# EasyEDA Pro project Control_Logic.eprj

# Schematic Schematic1
Board Name: Board1; Create Date: 2025-08-20; Page Name: P1; Project Name: Control_Logic; Schematic Name: Schematic1; Update Date: 2025-08-26; Company: EasyEDA.com; Page Size: A4; Version: V1.0
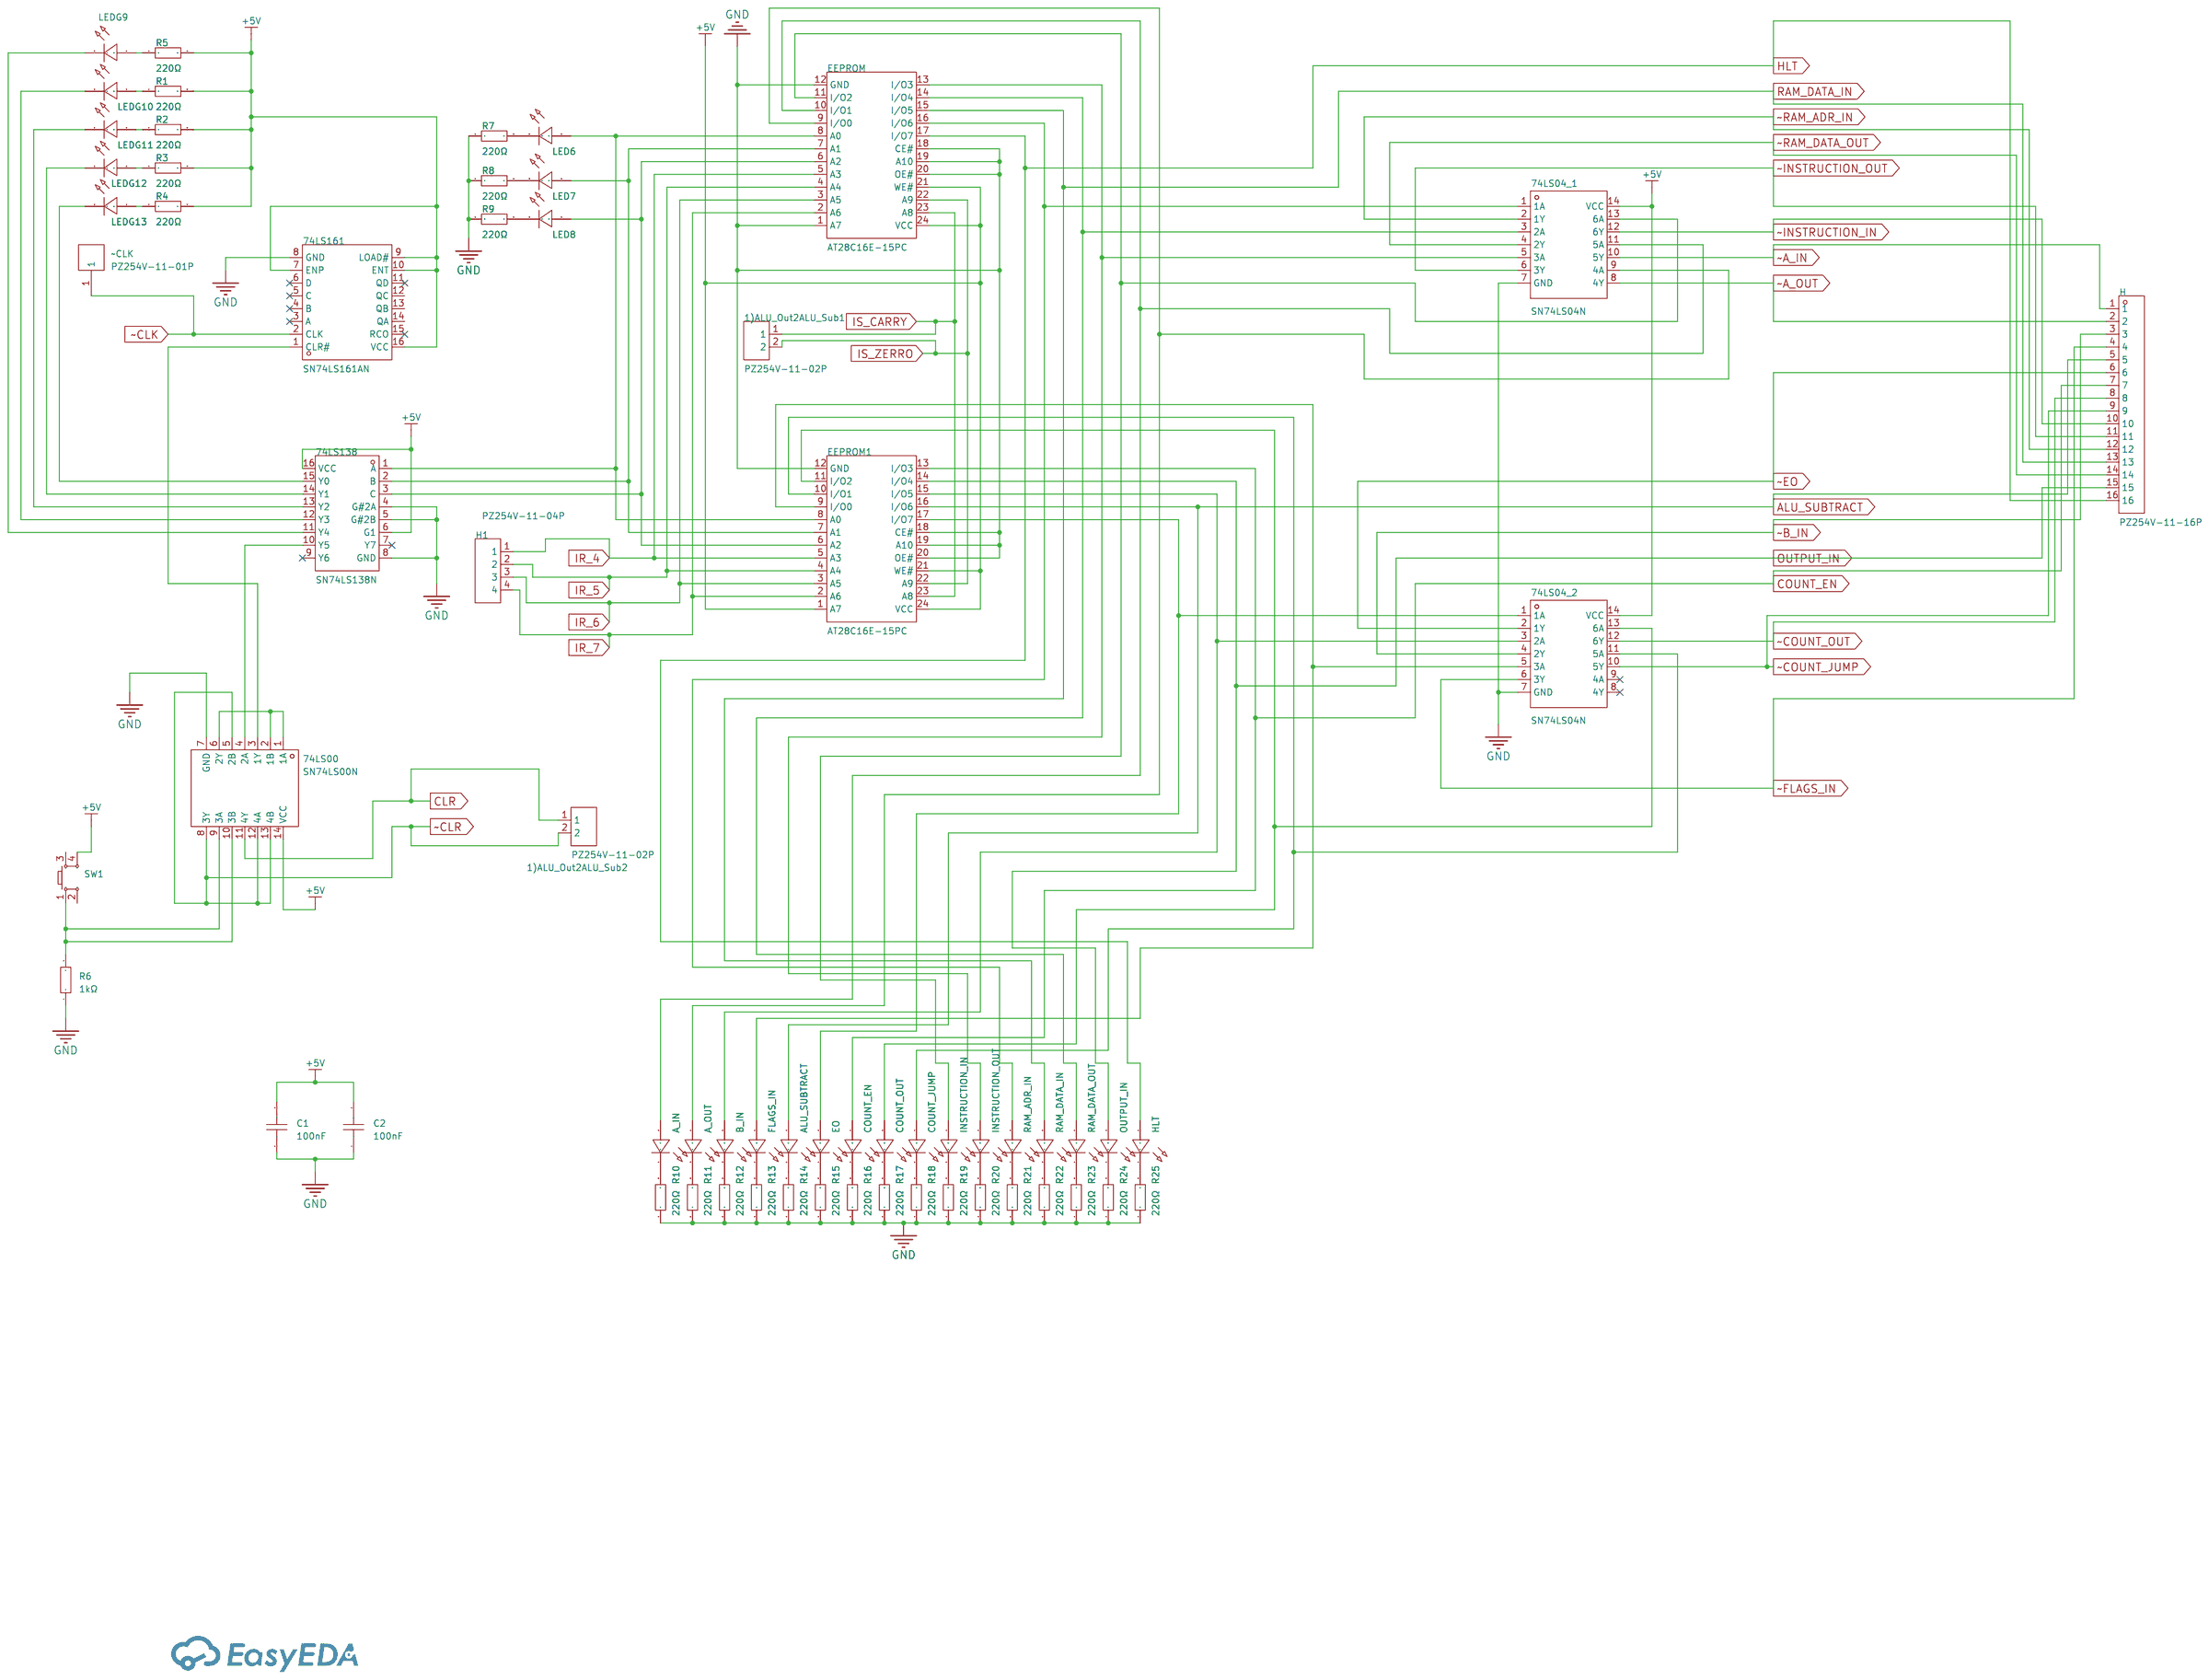
[diagram p0: schematic sheet]

## Parts
1)ALU_Out2ALU_Sub1  PZ254V-11-02P  [HDR-TH_2P-P2.54-V-M]
1)ALU_Out2ALU_Sub2  PZ254V-11-02P  [HDR-TH_2P-P2.54-V-M]
74LS00  SN74LS00N  [PDIP-14_L19.7-W6.6-P2.54-LS8.3-BL]
74LS04_1  SN74LS04N  [PDIP-14_L19.7-W6.6-P2.54-LS8.3-BL]
74LS04_2  SN74LS04N  [PDIP-14_L19.7-W6.6-P2.54-LS8.3-BL]
74LS138  SN74LS138N  [DIP-16_L19.8-W6.5-P2.54-LS7.6-BL]
74LS161  SN74LS161AN  [PDIP-16_L19.3-W6.4-P2.54-LS7.9-BL]
A_IN  -  [LED-TH_BD5.8-P2.54-FD]
A_OUT  -  [LED-TH_BD5.8-P2.54-FD]
ALU_SUBTRACT  -  [LED-TH_BD5.8-P2.54-FD]
B_IN  -  [LED-TH_BD5.8-P2.54-FD]
C1  100nF  [CAP-TH_L8.5-W5.0-P5.00-D1.2]
C2  100nF  [CAP-TH_L8.5-W5.0-P5.00-D1.2]
COUNT_EN  -  [LED-TH_BD5.8-P2.54-FD]
COUNT_JUMP  -  [LED-TH_BD5.8-P2.54-FD]
COUNT_OUT  -  [LED-TH_BD5.8-P2.54-FD]
EEPROM  AT28C16E-15PC  [PDIP-24_L31.0-W13.5-P2.54-LS15.2-BL]
EEPROM1  AT28C16E-15PC  [PDIP-24_L31.0-W13.5-P2.54-LS15.2-BL]
EO  -  [LED-TH_BD5.8-P2.54-FD]
FLAGS_IN  -  [LED-TH_BD5.8-P2.54-FD]
H  PZ254V-11-16P  [HDR-TH_PZ254V-11-16P]
H1  PZ254V-11-04P  [HDR-TH_4P-P2.54-V-M]
HLT  -  [LED-TH_BD5.8-P2.54-FD]
INSTRUCTION_IN  -  [LED-TH_BD5.8-P2.54-FD]
INSTRUCTION_OUT  -  [LED-TH_BD5.8-P2.54-FD]
LED6  -  [LED-TH_BD5.8-P2.54-FD]
LED7  -  [LED-TH_BD5.8-P2.54-FD]
LED8  -  [LED-TH_BD5.8-P2.54-FD]
LEDG9  -  [LED-TH_BD5.8-P2.54-FD]
LEDG10  -  [LED-TH_BD5.8-P2.54-FD]
LEDG11  -  [LED-TH_BD5.8-P2.54-FD]
LEDG12  -  [LED-TH_BD5.8-P2.54-FD]
LEDG13  -  [LED-TH_BD5.8-P2.54-FD]
OUTPUT_IN  -  [LED-TH_BD5.8-P2.54-FD]
R1  220Ω  [R_AXIAL-0.4]
R2  220Ω  [R_AXIAL-0.4]
R3  220Ω  [R_AXIAL-0.4]
R4  220Ω  [R_AXIAL-0.4]
R5  220Ω  [R_AXIAL-0.4]
R6  1kΩ  [R_AXIAL-0.4]
R7  220Ω  [R_AXIAL-0.4]
R8  220Ω  [R_AXIAL-0.4]
R9  220Ω  [R_AXIAL-0.4]
R10  220Ω  [R_AXIAL-0.4]
R11  220Ω  [R_AXIAL-0.4]
R12  220Ω  [R_AXIAL-0.4]
R13  220Ω  [R_AXIAL-0.4]
R14  220Ω  [R_AXIAL-0.4]
R15  220Ω  [R_AXIAL-0.4]
R16  220Ω  [R_AXIAL-0.4]
R17  220Ω  [R_AXIAL-0.4]
R18  220Ω  [R_AXIAL-0.4]
R19  220Ω  [R_AXIAL-0.4]
R20  220Ω  [R_AXIAL-0.4]
R21  220Ω  [R_AXIAL-0.4]
R22  220Ω  [R_AXIAL-0.4]
R23  220Ω  [R_AXIAL-0.4]
R24  220Ω  [R_AXIAL-0.4]
R25  220Ω  [R_AXIAL-0.4]
RAM_ADR_IN  -  [LED-TH_BD5.8-P2.54-FD]
RAM_DATA_IN  -  [LED-TH_BD5.8-P2.54-FD]
RAM_DATA_OUT  -  [LED-TH_BD5.8-P2.54-FD]
SW1  -  [KEY-TH_4P-L6.0-W6.0-P3.90-LS6.5]
~CLK  PZ254V-11-01P  [HDR-TH_1P-P2.54-V-M]

## Library data of the parts
1)ALU_Out2ALU_Sub1 1)ALU_Out2ALU_Sub2 = PZ254V-11-02P: Pin Structure:1x2P Pitch:2.54mm Row Spacing:- Circluar Pins/Square Pins:Policy Mounting Type:Straight Number of Rows:Single Row Number of Pins:2P Current Rating:- Voltage Rating (Max):- Length of Mating Pin:6mm Insulation Height:2.5mm Length of End Connec; LCSC Part Name: 1x2P 间距:2.54mm 方针 直插; Supplier Part: C492401; Manufacturer: XFCN(兴飞); Supplier Footprint: 插件,P=2.54mm; JLCPCB Part Class: Extended Part; Datasheet: https://atta.szlcsc.com/upload/public/pdf/source/20200309/C492401_A812433581A9B211A7FFA413ADDFF0E5.pdf; Supplier: LCSC; Pin Structure: 1x2P; Pitch: 2.54mm; Circluar Pins/Square Pins: Policy; Mounting Type: Straight; Number of Rows: Single Row; Number of Pins: 2P; Length of Mating Pin: 6mm; Insulation Height: 2.5mm; Length of End Connection Pin: 3mm; Contact Material: Brass; Operating Temperature: -40℃~+105℃; Color: Black
74LS00 = SN74LS00N: Logic Type:NAND Gate Number of Channels:4 Voltage - Supply:4.75V~5.25V Voltage - Supply:4.75V~5.25V Current - Output Low(IOL):8mA Current - Output High(IOH):400uA Input Logic Level - High:2V Input Logic Level - High:2V Input Logic Level - Low:800mV Input; Supplier Part: C181629; Manufacturer: TI(德州仪器); Supplier Footprint: PDIP-14; JLCPCB Part Class: Extended Part; Datasheet: https://www.ti.com/cn/lit/gpn/sn74ls00; Supplier: LCSC; Logic Type: NAND Gate; Number of Channels: 4; Voltage - Supply: 4.75V~5.25V; Current - Output Low(IOL): 8mA; Current - Output High(IOH): 400uA; Input Logic Level - High: 2V; Input Logic Level - Low: 800mV; Series: 74LSSeries; Propagation Delay: 15ns@5V,15pF; Operating Temperature: 0℃~+70℃
74LS04_1 74LS04_2 = SN74LS04N: Voltage - Supply:4.75V~5.25V Voltage - Supply:4.75V~5.25V Number of Circuits:6 Number of Inputs:1 Current - Output Low(IOL):8mA Current - Output High(IOH):400uA Input Logic Level - High:2V Input Logic Level - High:2V Input Logic Level -Low:800mV Input Log; Supplier Part: C183657; Manufacturer: TI(德州仪器); Supplier Footprint: PDIP-14; JLCPCB Part Class: Extended Part; Datasheet: https://www.ti.com/cn/lit/gpn/sn74ls04; Supplier: LCSC; Voltage - Supply: 4.75V~5.25V; Number of Circuits: 6; Number of Inputs: 1; Current - Output Low(IOL): 8mA; Current - Output High(IOH): 400uA; Input Logic Level - High: 2V; Input Logic Level -Low: 800mV; Max Propagation Delay: 15ns@5V,15pF; Series: 74LSSeries; Operating Temperature: 0℃~+70℃
74LS138 = SN74LS138N: Type:Decoder/Demultiplexers Voltage Supply Source:Single supply Supply Voltage:4.75V~5.25V Supply Voltage:4.75V~5.25V Sink Current:8mA Source Current:400uA Operating temperature:0℃~+70℃ Operating temperature:0℃~+70℃; Supplier Part: C352964; Manufacturer: TI(德州仪器); Supplier Footprint: DIP-16; JLCPCB Part Class: Extended Part; Datasheet: https://www.ti.com/cn/lit/gpn/sn74ls138; Supplier: LCSC; Type: Decoder/Demultiplexers; Voltage Supply Source: Single supply; Supply Voltage: 4.75V~5.25V; Sink Current: 8mA; Source Current: 400uA; Operating temperature: 0℃~+70℃
74LS161 = SN74LS161AN: Logic Type:Binary Counter Direction:向上计数器 Supply Voltage:4.75V~5.25V Supply Voltage:4.75V~5.25V Number of Elements:1 Number of Bits per Element:4 Trigger Type:Positive Edge Reset Style:异步 Timing mode:Synchronous Count Rate:25MHz Operating Temperature:0℃~+; LCSC Part Name: 25MHz 4位二进制计数器; Supplier Part: C1547960; Manufacturer: TI(德州仪器); Supplier Footprint: PDIP-16; JLCPCB Part Class: Extended Part; Datasheet: https://www.ti.com/cn/lit/gpn/sn74ls161a; Supplier: LCSC; Logic Type: Binary Counter; Direction: 向上计数器; Supply Voltage: 4.75V~5.25V; Number of Elements: 1; Number of Bits per Element: 4; Trigger Type: Positive Edge; Reset Style: 异步; Timing mode: Synchronous; Count Rate: 25MHz; Operating Temperature: 0℃~+70℃
A_IN A_OUT ALU_SUBTRACT B_IN COUNT_EN COUNT_JUMP COUNT_OUT EO FLAGS_IN HLT INSTRUCTION_IN INSTRUCTION_OUT LED6-LED8 LEDG9-LEDG13 OUTPUT_IN RAM_ADR_IN RAM_DATA_IN RAM_DATA_OUT = LED_TH-R_5mm: Supplier Footprint: Through
C1 C2 = CT4-0805B104K500F3: Capacitance:100nF Tolerance:±10% Tolerance:±10% Voltage Rated: Temperature Coefficient:; LCSC Part Name: 100nF ±10% 50V C3型（直脚）; Supplier Part: C84772; Manufacturer: FH(风华); Supplier Footprint: 插件,P=5.08mm; JLCPCB Part Class: Extended Part; Datasheet: https://atta.szlcsc.com/upload/public/pdf/source/20190402/C385200_059806A6312B28FF1421A2413EB641E1.pdf; Supplier: LCSC; Tolerance: ±10%
EEPROM EEPROM1 = AT28C16E-15PC: Supplier Part: C19393057; Manufacturer: MICROCHIP(美国微芯); Supplier Footprint: PDIP-24; JLCPCB Part Class: Extended Part; Datasheet: https://atta.szlcsc.com/upload/public/pdf/source/20231219/98B154FA288F53C07025EE50A49045E4.pdf; Supplier: LCSC
H = PZ254V-11-16P: LCSC Part Name: 排针2.54mm间距 单排 1x16P 直插 方针; Supplier Part: C22465876; Manufacturer: XFCN(兴飞); Supplier Footprint: 插件,P=2.54mm; JLCPCB Part Class: Extended Part; Datasheet: https://atta.szlcsc.com/upload/public/pdf/source/20240617/C325FF89D0FCE13B2A10BE2D3D7E6B84.pdf; Supplier: LCSC
H1 = PZ254V-11-04P_C492403: Pin Structure:1x4P Pitch:2.54mm Row Spacing:- Circluar Pins/Square Pins:Policy Mounting Type:Straight Number of Rows:Single Row Number of Pins:4P Current Rating:- Voltage Rating (Max):- Length of Mating Pin:6mm Insulation Height:2.5mm Length of End Connec; LCSC Part Name: 1x4P 间距:2.54mm 方针 直插; Supplier Part: C492403; Manufacturer: XFCN(兴飞); Supplier Footprint: 插件,P=2.54mm; JLCPCB Part Class: Extended Part; Datasheet: https://atta.szlcsc.com/upload/public/pdf/source/20200309/C492403_F9F19131791D08044AD4F84F8E751A34.pdf; Supplier: LCSC; Pin Structure: 1x4P; Pitch: 2.54mm; Circluar Pins/Square Pins: Policy; Mounting Type: Straight; Number of Rows: Single Row; Number of Pins: 4P; Length of Mating Pin: 6mm; Insulation Height: 2.5mm; Length of End Connection Pin: 3mm; Contact Material: Brass; Operating Temperature: -40℃~+105℃; Color: Black
R1-R25 = Res_AXIAL-1/4W: Supplier Footprint: Through
SW1 = Key_TH_6x6x4.5: Supplier Footprint: Through
~CLK = PZ254V-11-01P: LCSC Part Name: 1x1P 间距:2.54mm 方针 直插; Supplier Part: C492400; Manufacturer: XFCN(兴飞); Supplier Footprint: 插件,P=2.54mm; JLCPCB Part Class: Extended Part; Datasheet: https://atta.szlcsc.com/upload/public/pdf/source/20200309/C492400_46876A5B545F5AE6B8D4A09C46E276E8.pdf; Supplier: LCSC; Pin Structure: 1x1P; Pitch: 2.54mm; Circluar Pins/Square Pins: Policy; Mounting Type: Straight; Number of Rows: Single Row; Number of Pins: 1P; Length of Mating Pin: 6mm; Insulation Height: 2.5mm; Length of End Connection Pin: 3mm; Contact Material: Brass; Operating Temperature: -40℃~+105℃; Color: Black

## Nets
+5V: 74LS00.14(VCC) 74LS04_1.14(VCC) 74LS04_2.14(VCC) 74LS138.6(G1) 74LS138.16(VCC) 74LS161.7(ENP) 74LS161.9(LOAD#) 74LS161.10(ENT) 74LS161.16(VCC) C1.2 C2.2 EEPROM.21(WE#) EEPROM.24(VCC) EEPROM1.1(A7) EEPROM1.21(WE#) EEPROM1.24(VCC) R1.2 R2.2 R3.2 R4.2 R5.2 SW1.4
GND: 74LS00.7(GND) 74LS04_1.7(GND) 74LS04_2.7(GND) 74LS138.4(G#2A) 74LS138.5(G#2B) 74LS138.8(GND) 74LS161.8(GND) C1.1 C2.1 EEPROM.1(A7) EEPROM.12(GND) EEPROM.18(CE#) EEPROM.19(A10) EEPROM.20(OE#) EEPROM1.12(GND) EEPROM1.18(CE#) EEPROM1.19(A10) EEPROM1.20(OE#) R6.1 R7.1 R8.1 R9.1 R10.1 R11.1 R12.1 R13.1 R14.1 R15.1 R16.1 R17.1 R18.1 R19.1 R20.1 R21.1 R22.1 R23.1 R24.1 R25.1
ALU_SUBTRACT: ALU_SUBTRACT.1(C) EEPROM1.16(I/O6) H.5
CLR: 1)ALU_Out2ALU_Sub2.1 74LS00.11(4Y)
COUNT_EN: COUNT_EN.1(C) EEPROM1.13(I/O3) H.7
HLT: EEPROM.17(I/O7) H.16 HLT.1(C)
IR_4: EEPROM.5(A3) EEPROM1.5(A3) H1.1
IR_5: EEPROM.4(A4) EEPROM1.4(A4) H1.2
IR_6: EEPROM.3(A5) EEPROM1.3(A5) H1.3
IR_7: EEPROM.2(A6) EEPROM1.2(A6) H1.4
IS_CARRY: 1)ALU_Out2ALU_Sub1.1 EEPROM.23(A8) EEPROM1.23(A8)
IS_ZERRO: 1)ALU_Out2ALU_Sub1.2 EEPROM.22(A9) EEPROM1.22(A9)
OUTPUT_IN: EEPROM1.14(I/O4) H.15 OUTPUT_IN.1(C)
RAM_DATA_IN: EEPROM.15(I/O5) H.13 RAM_DATA_IN.1(C)
~A_IN: 74LS04_1.10(5Y) H.1
~A_OUT: 74LS04_1.8(4Y) H.2
~B_IN: 74LS04_2.4(2Y) H.3
~CLK: 74LS161.2(CLK) ~CLK.1
~CLR: 1)ALU_Out2ALU_Sub2.2 74LS00.5(2B) 74LS00.8(3Y) 74LS00.12(4A) 74LS00.13(4B)
~COUNT_JUMP: 74LS04_2.10(5Y) H.9
~COUNT_OUT: 74LS04_2.12(6Y) H.8
~EO: 74LS04_2.2(1Y) H.6
~FLAGS_IN: 74LS04_2.6(3Y) H.4
~INSTRUCTION_IN: 74LS04_1.12(6Y) H.10
~INSTRUCTION_OUT: 74LS04_1.6(3Y) H.11
~RAM_ADR_IN: 74LS04_1.2(1Y) H.12
~RAM_DATA_OUT: 74LS04_1.4(2Y) H.14
$1N2639: LEDG9.1(C) R5.1
$1N2640: LEDG10.1(C) R1.1
$1N2641: LEDG11.1(C) R2.1
$1N2642: LEDG12.1(C) R3.1
$1N2643: LEDG13.1(C) R4.1
$1N2644: 74LS138.15(Y0) LEDG13.2(A)
$1N2645: 74LS138.11(Y4) LEDG9.2(A)
$1N2646: 74LS138.14(Y1) LEDG12.2(A)
$1N2647: 74LS138.13(Y2) LEDG11.2(A)
$1N2648: 74LS138.12(Y3) LEDG10.2(A)
$1N2653: 74LS00.9(3A) 74LS00.10(3B) R6.2 SW1.1
$1N2655: 74LS00.4(2A) 74LS138.10(Y5)
$1N2658: 74LS00.1(1A) 74LS00.2(1B) 74LS00.6(2Y)
$1N2659: 74LS00.3(1Y) 74LS161.1(CLR#)
$1N2661: 74LS138.1(A) EEPROM.8(A0) EEPROM1.8(A0) LED6.1(C)
$1N2662: 74LS138.2(B) EEPROM.7(A1) EEPROM1.7(A1) LED7.1(C)
$1N2666: LED6.2(A) R7.2
$1N2667: LED7.2(A) R8.2
$1N2668: LED8.2(A) R9.2
$1N2703: 74LS138.3(C) EEPROM.6(A2) EEPROM1.6(A2) LED8.1(C)
$1N12063: 74LS04_1.3(2A) EEPROM.14(I/O4) RAM_DATA_OUT.1(C)
$1N12068: 74LS04_2.11(5A) COUNT_JUMP.1(C) EEPROM1.10(I/O1)
$1N12073: 74LS04_2.13(6A) COUNT_OUT.1(C) EEPROM1.11(I/O2)
$1N12083: 74LS04_2.1(1A) EEPROM1.17(I/O7) EO.1(C)
$1N12093: 74LS04_2.5(3A) EEPROM1.9(I/O0) FLAGS_IN.1(C)
$1N12098: 74LS04_2.3(2A) B_IN.1(C) EEPROM1.15(I/O5)
$1N12103: 74LS04_1.9(4A) A_OUT.1(C) EEPROM.9(I/O0)
$1N12108: 74LS04_1.11(5A) A_IN.1(C) EEPROM.10(I/O1)
$1N12115: 74LS04_1.13(6A) EEPROM.11(I/O2) INSTRUCTION_IN.1(C)
$1N12122: 74LS04_1.5(3A) EEPROM.13(I/O3) INSTRUCTION_OUT.1(C)
$1N12129: 74LS04_1.1(1A) EEPROM.16(I/O6) RAM_ADR_IN.1(C)
$1N12393: A_IN.2(A) R10.2
$1N12395: A_OUT.2(A) R11.2
$1N12397: B_IN.2(A) R12.2
$1N12399: FLAGS_IN.2(A) R13.2
$1N12401: ALU_SUBTRACT.2(A) R14.2
$1N12403: EO.2(A) R15.2
$1N12405: COUNT_EN.2(A) R16.2
$1N12407: COUNT_OUT.2(A) R17.2
$1N12409: COUNT_JUMP.2(A) R18.2
$1N12411: INSTRUCTION_IN.2(A) R19.2
$1N12413: INSTRUCTION_OUT.2(A) R20.2
$1N12415: R21.2 RAM_ADR_IN.2(A)
$1N12417: R22.2 RAM_DATA_IN.2(A)
$1N12419: R23.2 RAM_DATA_OUT.2(A)
$1N12421: OUTPUT_IN.2(A) R24.2
$1N12423: HLT.2(A) R25.2

Not connected (* = marked no-connect by the designer): 74LS04_2 8(4Y)* 9(4A)*; 74LS138 7(Y7)* 9(Y6)*; 74LS161 3(A)* 4(B)* 5(C)* 6(D)* 11(QD)* 12(QC) 13(QB) 14(QA) 15(RCO)*; SW1 2 3

# Board PCB1
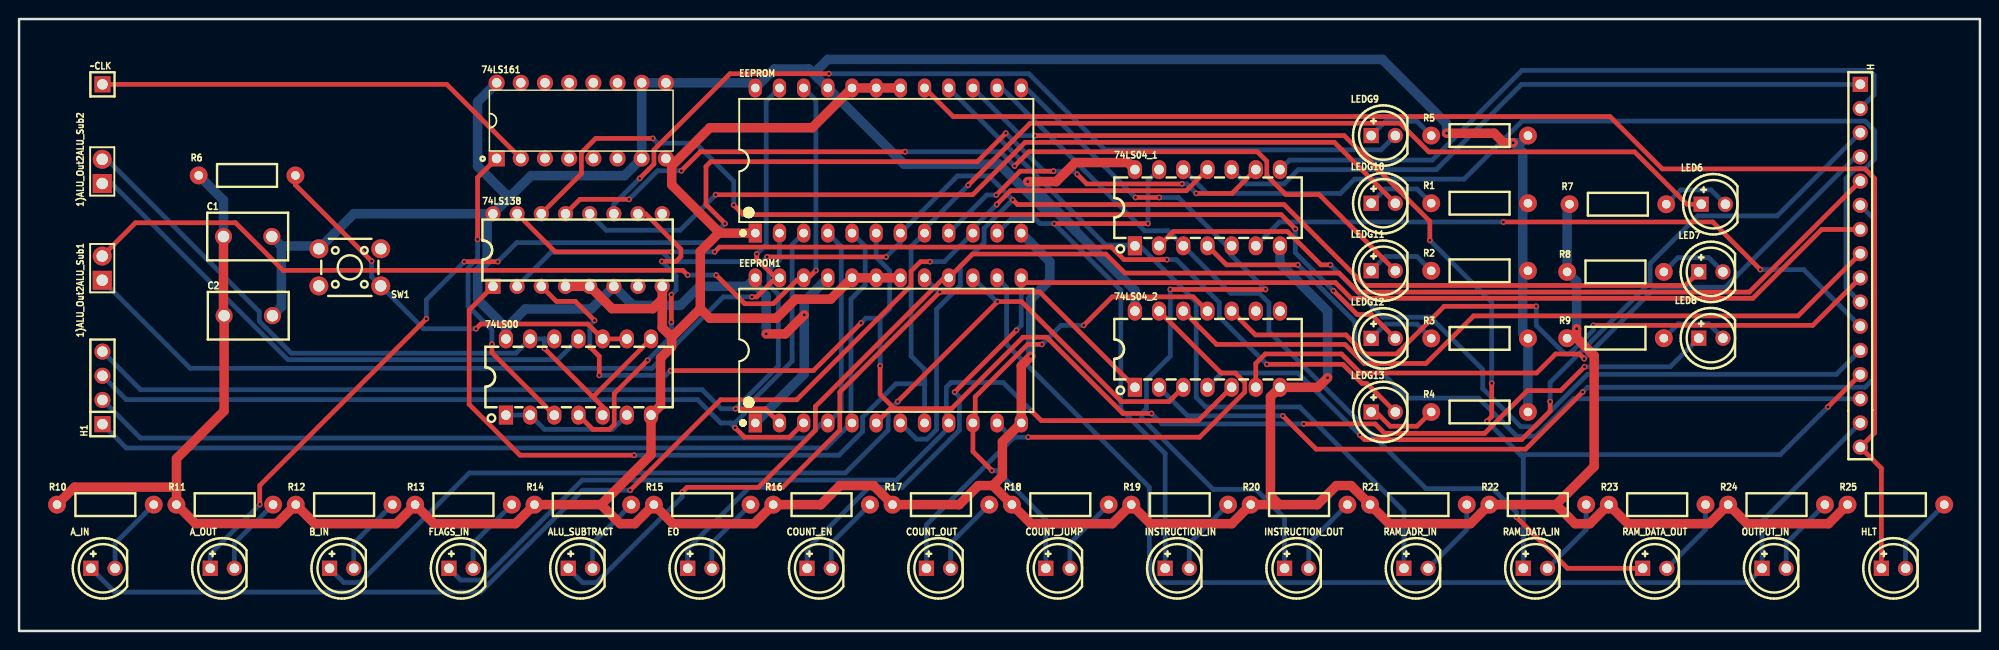
[diagram p1: board, top side]
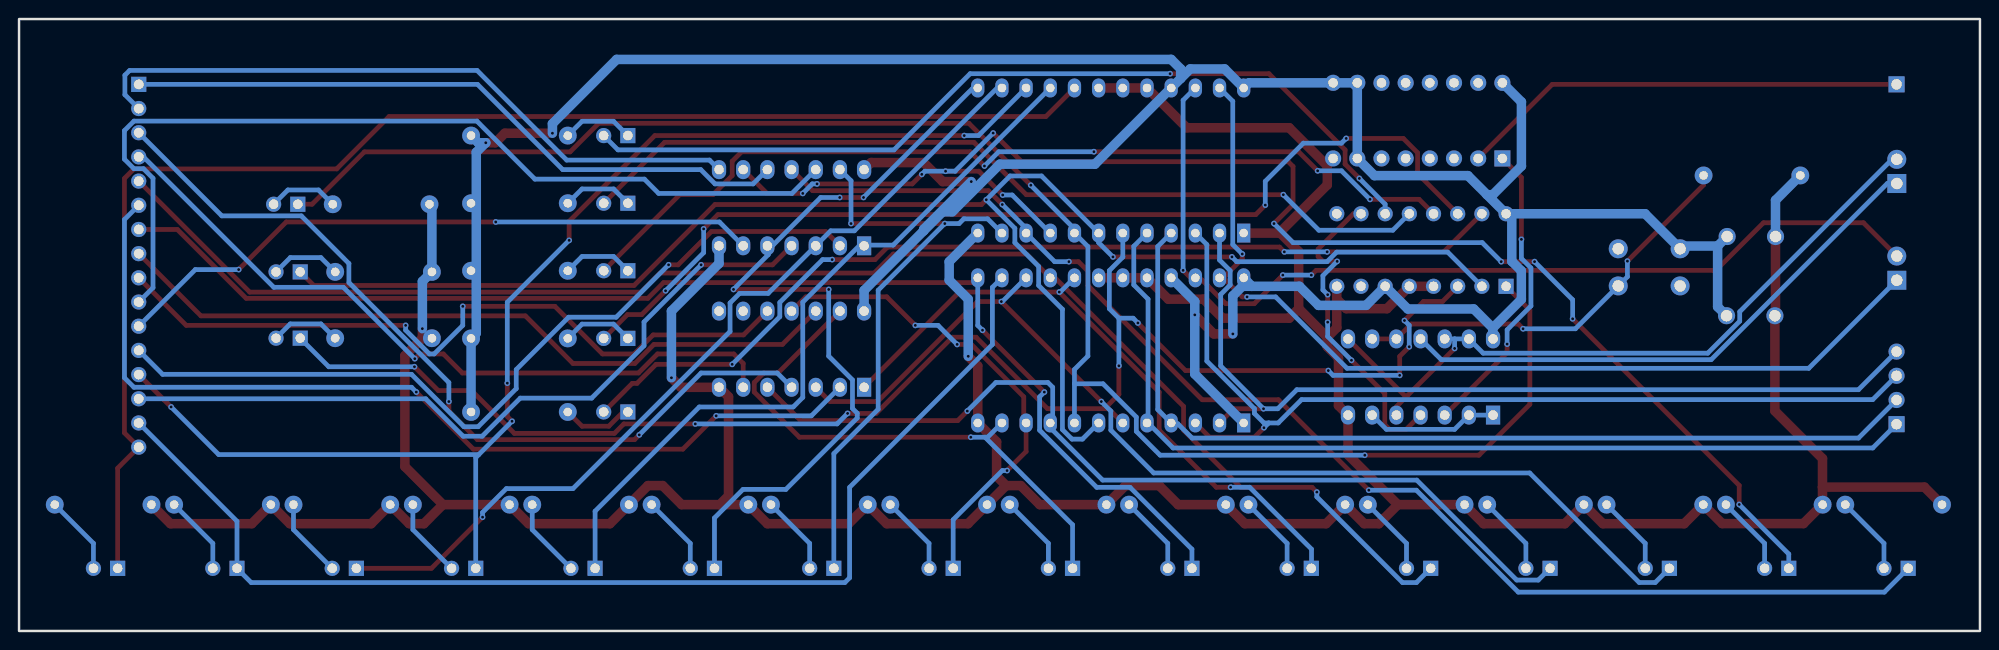
[diagram p2: board, bottom side, seen from below]

Outline 205.99 x 64.26 mm; copper layers: Top Layer, Bottom Layer. Coordinates in mm from the lower left corner of the outline.
Outline path: rectangle 0,64.26 205.99,0
Stack: Top Layer 0.035mm / Dielectric1 1.51mm FR4 er 4.5 / Bottom Layer 0.035mm

## Design rules (mm)
template: Custom Config
spacing copperThickness1oz (default): track to track 0.102, other pairs 0.152 to 0.3
spacing copperThickness2oz: track to track 0.203, other pairs 0.152 to 0.3
track width copperThickness1oz (default): min 0.127, default 0.5, max 2.54
track width copperThickness2oz: min 0.203, default 1, max 2.54
differential pair differentialPair (default): width min 0.127, default 0.254, max 2.54; gap min 0.152, default 0.152
via viaSize (default): diameter min 0.5, default 0.61, max 10; hole min 0.3, default 0.305, max 6.3
net GND uses copperThickness2oz
net +5V uses copperThickness2oz

## Placement (name value [footprint] x y rotation side)
1)ALU_Out2ALU_Sub1  PZ254V-11-02P  [HDR-TH_2P-P2.54-V-M]  8.74 38.1 90 top
1)ALU_Out2ALU_Sub2  PZ254V-11-02P  [HDR-TH_2P-P2.54-V-M]  8.74 48.26 90 top
74LS00  SN74LS00N  [PDIP-14_L19.7-W6.6-P2.54-LS8.3-BL]  58.77 26.67 0 top
74LS04_1  SN74LS04N  [PDIP-14_L19.7-W6.6-P2.54-LS8.3-BL]  124.84 44.45 0 top
74LS04_2  SN74LS04N  [PDIP-14_L19.7-W6.6-P2.54-LS8.3-BL]  124.84 29.59 0 top
74LS138  SN74LS138N  [DIP-16_L19.8-W6.5-P2.54-LS7.6-BL]  58.67 40.01 0 top
74LS161  SN74LS161AN  [PDIP-16_L19.3-W6.4-P2.54-LS7.9-BL]  59.06 53.59 0 top
A_IN  -  [LED-TH_BD5.8-P2.54-FD]  8.81 6.58 0 top
A_OUT  -  [LED-TH_BD5.8-P2.54-FD]  21.35 6.58 0 top
ALU_SUBTRACT  -  [LED-TH_BD5.8-P2.54-FD]  58.97 6.58 0 top
B_IN  -  [LED-TH_BD5.8-P2.54-FD]  33.89 6.58 0 top
C1  100nF  [CAP-TH_L8.5-W5.0-P5.00-D1.2]  24.02 41.42 0 top
C2  100nF  [CAP-TH_L8.5-W5.0-P5.00-D1.2]  24.08 33.11 0 top
COUNT_EN  -  [LED-TH_BD5.8-P2.54-FD]  84.05 6.58 0 top
COUNT_JUMP  -  [LED-TH_BD5.8-P2.54-FD]  109.13 6.58 0 top
COUNT_OUT  -  [LED-TH_BD5.8-P2.54-FD]  96.59 6.58 0 top
EEPROM  AT28C16E-15PC  [PDIP-24_L31.0-W13.5-P2.54-LS15.2-BL]  91.31 49.4 0 top
EEPROM1  AT28C16E-15PC  [PDIP-24_L31.0-W13.5-P2.54-LS15.2-BL]  91.31 29.46 0 top
EO  -  [LED-TH_BD5.8-P2.54-FD]  71.51 6.58 0 top
FLAGS_IN  -  [LED-TH_BD5.8-P2.54-FD]  46.43 6.58 0 top
H  PZ254V-11-16P  [HDR-TH_PZ254V-11-16P]  193.42 38.35 270 top
H1  PZ254V-11-04P  [HDR-TH_4P-P2.54-V-M]  8.76 25.53 90 top
HLT  -  [LED-TH_BD5.8-P2.54-FD]  196.91 6.58 0 top
INSTRUCTION_IN  -  [LED-TH_BD5.8-P2.54-FD]  121.67 6.58 0 top
INSTRUCTION_OUT  -  [LED-TH_BD5.8-P2.54-FD]  134.21 6.58 0 top
LED6  -  [LED-TH_BD5.8-P2.54-FD]  177.98 44.81 0 top
LED7  -  [LED-TH_BD5.8-P2.54-FD]  177.73 37.71 0 top
LED8  -  [LED-TH_BD5.8-P2.54-FD]  177.73 30.75 0 top
LEDG9  -  [LED-TH_BD5.8-P2.54-FD]  143.31 52.02 0 top
LEDG10  -  [LED-TH_BD5.8-P2.54-FD]  143.31 44.92 0 top
LEDG11  -  [LED-TH_BD5.8-P2.54-FD]  143.31 37.83 0 top
LEDG12  -  [LED-TH_BD5.8-P2.54-FD]  143.31 30.72 0 top
LEDG13  -  [LED-TH_BD5.8-P2.54-FD]  143.31 23 0 top
OUTPUT_IN  -  [LED-TH_BD5.8-P2.54-FD]  184.37 6.58 0 top
R1  220Ω  [R_AXIAL-0.4]  153.43 44.92 0 top
R2  220Ω  [R_AXIAL-0.4]  153.43 37.83 0 top
R3  220Ω  [R_AXIAL-0.4]  153.43 30.72 0 top
R4  220Ω  [R_AXIAL-0.4]  153.43 23 0 top
R5  220Ω  [R_AXIAL-0.4]  153.43 52.02 0 top
R6  1kΩ  [R_AXIAL-0.4]  23.95 47.84 0 top
R7  220Ω  [R_AXIAL-0.4]  167.96 44.81 0 top
R8  220Ω  [R_AXIAL-0.4]  167.7 37.71 0 top
R9  220Ω  [R_AXIAL-0.4]  167.7 30.75 0 top
R10  220Ω  [R_AXIAL-0.4]  9.07 13.27 0 top
R11  220Ω  [R_AXIAL-0.4]  21.61 13.27 0 top
R12  220Ω  [R_AXIAL-0.4]  34.15 13.27 0 top
R13  220Ω  [R_AXIAL-0.4]  46.69 13.27 0 top
R14  220Ω  [R_AXIAL-0.4]  59.23 13.27 0 top
R15  220Ω  [R_AXIAL-0.4]  71.77 13.27 0 top
R16  220Ω  [R_AXIAL-0.4]  84.31 13.27 0 top
R17  220Ω  [R_AXIAL-0.4]  96.85 13.27 0 top
R18  220Ω  [R_AXIAL-0.4]  109.38 13.27 0 top
R19  220Ω  [R_AXIAL-0.4]  121.92 13.27 0 top
R20  220Ω  [R_AXIAL-0.4]  134.46 13.27 0 top
R21  220Ω  [R_AXIAL-0.4]  147 13.27 0 top
R22  220Ω  [R_AXIAL-0.4]  159.54 13.27 0 top
R23  220Ω  [R_AXIAL-0.4]  172.08 13.27 0 top
R24  220Ω  [R_AXIAL-0.4]  184.62 13.27 0 top
R25  220Ω  [R_AXIAL-0.4]  197.16 13.27 0 top
RAM_ADR_IN  -  [LED-TH_BD5.8-P2.54-FD]  146.75 6.58 0 top
RAM_DATA_IN  -  [LED-TH_BD5.8-P2.54-FD]  159.29 6.58 0 top
RAM_DATA_OUT  -  [LED-TH_BD5.8-P2.54-FD]  171.83 6.58 0 top
SW1  -  [KEY-TH_4P-L6.0-W6.0-P3.90-LS6.5]  34.75 38.19 180 top
~CLK  PZ254V-11-01P  [HDR-TH_1P-P2.54-V-M]  8.76 57.4 0 top

## Footprints (pads in the part's own frame, mm; a bottom-side part is the same pattern mirrored in y, then rotated)
CAP-TH_L8.5-W5.0-P5.00-D1.2
  round 1.8 hole 1.2: 1(-2.54,0) 2(2.54,0)
DIP-16_L19.8-W6.5-P2.54-LS7.6-BL
  rect 1.6x1.6 hole 1: 1(-8.89,-3.81)
  round 1.6 hole 1: 2(-6.35,-3.81) 3(-3.81,-3.81) 4(-1.27,-3.81) 5(1.27,-3.81) 6(3.81,-3.81) 7(6.35,-3.81) 8(8.89,-3.81) 9(8.89,3.81) 10(6.35,3.81) 11(3.81,3.81) 12(1.27,3.81) 13(-1.27,3.81) 14(-3.81,3.81) 15(-6.35,3.81) 16(-8.89,3.81)
HDR-TH_1P-P2.54-V-M
  rect 1.7x1.7 hole 1.1: 1(0,0)
HDR-TH_2P-P2.54-V-M
  rect 2x2 hole 1.2: 1(-1.27,0)
  round 2 hole 1.2: 2(1.27,0)
HDR-TH_4P-P2.54-V-M
  rect 1.7x1.7 hole 1.1: 1(-3.81,0)
  round 1.7 hole 1.1: 2(-1.27,0) 3(1.27,0) 4(3.81,0)
HDR-TH_PZ254V-11-16P
  rect 1.6x1.6 hole 1.02: 1(-19.05,0)
  round 1.6 hole 1.02: 2(-16.51,0) 3(-13.97,0) 4(-11.43,0) 5(-8.89,0) 6(-6.35,0) 7(-3.81,0) 8(-1.27,0) 9(1.27,0) 10(3.81,0) 11(6.35,0) 12(8.89,0) 13(11.43,0) 14(13.97,0) 15(16.51,0) 16(19.05,0)
KEY-TH_4P-L6.0-W6.0-P3.90-LS6.5
  round 2 hole 1.2: 1(-3.25,1.95) 2(3.25,1.95) 3(-3.25,-1.95) 4(3.25,-1.95)
LED-TH_BD5.8-P2.54-FD
  rect 1.6x1.6 hole 1: 1(-1.27,0)
  round 1.6 hole 1: 2(1.27,0)
PDIP-14_L19.7-W6.6-P2.54-LS8.3-BL
  rect 1.5x2 hole 1: 1(-7.62,-4)
  oval 1.5x2 hole 1: 2(-5.08,-4) 3(-2.54,-4) 4(0,-4) 5(2.54,-4) 6(5.08,-4) 7(7.62,-4) 8(7.62,4) 9(5.08,4) 10(2.54,4) 11(0,4) 12(-2.54,4) 13(-5.08,4) 14(-7.62,4)
PDIP-16_L19.3-W6.4-P2.54-LS7.9-BL
  rect 1.7x1.7 hole 1: 1(-8.89,-3.97)
  round 1.7 hole 1: 2(-6.35,-3.97) 3(-3.81,-3.97) 4(-1.27,-3.97) 5(1.27,-3.97) 6(3.81,-3.97) 7(6.35,-3.97) 8(8.89,-3.97) 9(8.89,3.97) 10(6.35,3.97) 11(3.81,3.97) 12(1.27,3.97) 13(-1.27,3.97) 14(-3.81,3.97) 15(-6.35,3.97) 16(-8.89,3.97)
PDIP-24_L31.0-W13.5-P2.54-LS15.2-BL
  rect 1.4x2 hole 0.9: 1(-13.97,-7.62)
  oval 1.4x2 hole 0.9: 2(-11.43,-7.62) 3(-8.89,-7.62) 4(-6.35,-7.62) 5(-3.81,-7.62) 6(-1.27,-7.62) 7(1.27,-7.62) 8(3.81,-7.62) 9(6.35,-7.62) 10(8.89,-7.62) 11(11.43,-7.62) 12(13.97,-7.62) 13(13.97,7.62) 14(11.43,7.62) 15(8.89,7.62) 16(6.35,7.62) 17(3.81,7.62) 18(1.27,7.62) 19(-1.27,7.62) 20(-3.81,7.62) 21(-6.35,7.62) 22(-8.89,7.62) 23(-11.43,7.62) 24(-13.97,7.62)
R_AXIAL-0.4
  round 1.879 hole 0.899: 1(-5.08,0) 2(5.08,0)

## Nets
As in the schematic.

Pads without a net: 74LS04_2 8 9; 74LS138 7 9; 74LS161 3 4 5 6 11 12 13 14 15; SW1 2 3

## Via types
v1: diameter 0.61, hole 0.305, Top Layer to Bottom Layer, 102 vias

## Routing (per net, layer and track width the routed paths; a pad name or vN(x,y) marks a point on that pad's centre or on a via; arc(x,y) is an arc through that point)
+5V: length 343
  Top Layer w1: v1(78.48,31.2) 80.48,31.2 v1(82.48,33.2) ; v1(149.96,52.27) 154.96,52.27 155.96,51.27 v1(156.96,51.27) ; 74LS04_1.14 116.48,49.19 110.96,49.19 108.96,47.19 v1(105.96,47.19)
  Bottom Layer w1: 74LS161.16 48.17,55.56 48.17,48.82 51.17,45.82 51.78,45.82 ; R2.2 158.07,38.27 157.96,38.27 ; 51.18,31.82 53.18,33.82 60.1,33.82 74LS138.6 64.48,34.2 69.48,34.2 71.48,36.2 76.48,36.2 ; 51.18,31.82 51.18,30.7 74LS00.14 ; 51.18,31.82 48.18,34.82 48.18,37.82 49.18,38.82 49.18,43.82 ; 157.96,38.27 157.96,31.27 R3.2 R4.2 ; 157.96,38.27 157.96,45.27 ; 51.78,45.82 74LS138.16 49.18,43.82 ; 51.78,45.82 53.78,47.82 63.6,47.82 74LS161.7 74LS161.10 74LS161.9 76.8,57.56 EEPROM.24 79.34,59.02 82.96,59.02 83.96,58.02 ; 27.56,40.42 27.56,34.04 C2.2 ; 27.56,40.42 31.21,40.42 SW1.4 35.18,43.82 49.18,43.82 ; 27.56,40.42 C1.2 ; 110.96,42.02 108.96,44.02 107.96,44.02 102.96,49.02 92.96,49.02 EEPROM.21 83.96,58.02 ; 110.96,42.02 117.22,35.77 74LS04_2.14 ; 110.96,42.02 110.96,42.19 v1(105.96,47.19) ; v1(149.96,52.27) 149.96,53.27 143.21,60.02 84.96,60.02 83.96,59.02 83.96,58.02 ; EEPROM1.1 82.48,26.99 v1(82.48,33.2) 82.48,34.61 84.96,37.08 ; R5.2 157.76,51.27 v1(156.96,51.27) 157.96,50.27 157.96,45.27 ; 76.48,36.2 77.34,37.08 ; 76.48,36.2 77.48,36.2 78.48,35.2 v1(78.48,31.2) ; 157.96,45.27 158.16,45.27 R1.2
GND: length 465.5
  Top Layer w1: 67.56,34.85 66.56,33.85 62.29,33.85 74LS138.5 57.4,36.2 ; 67.56,34.85 74LS138.8 ; 67.56,34.85 67.56,31.85 68.56,30.85 ; 68.56,30.85 71.56,33.85 ; 68.56,30.85 68.56,29.85 67.39,28.67 67.39,23.67 74LS00.7 66.39,18.51 61.15,13.27 ; 71.56,33.85 72.56,32.85 79.56,32.85 81.56,34.85 85.27,34.85 87.5,37.08 92.58,37.08 ; 71.56,33.85 71.56,39.85 73.56,41.85 ; 73.56,41.85 68.56,46.85 68.56,48.85 ; 73.56,41.85 73.63,41.78 EEPROM.1 ; 132.38,13.27 136.38,13.27 138.38,15.27 139.92,15.27 R21.1 143.92,11.27 152.46,11.27 R22.1 161.46,13.27 ; 132.38,13.27 131.46,14.19 131.46,24.59 74LS04_2.7 136.46,25.59 v1(137.46,26.59) ; 132.38,13.27 R20.1 127.38,11.27 118.84,11.27 R19.1 114.84,11.27 106.3,11.27 R18.1 102.3,15.27 ; 102.3,15.27 100.77,15.27 98.77,13.27 R17.1 89.77,15.27 86.23,15.27 84.23,13.27 R16.1 77.23,11.27 68.69,11.27 R15.1 64.69,11.27 63.15,11.27 61.15,13.27 ; 102.3,15.27 103.3,16.27 103.3,19.87 EEPROM1.12 105.28,27.84 v1(106.28,28.84) ; 163.62,30.75 165.46,28.91 165.46,17.27 161.46,13.27 ; 163.62,30.75 R9.1 ; 163.62,30.75 v1(163.62,31.75) ; 161.46,13.27 163.46,11.27 165,11.27 R23.1 169,11.27 177.54,11.27 179.54,13.27 181.54,11.27 190.08,11.27 192.08,13.27 ; 68.56,48.85 72.56,52.85 83.33,52.85 EEPROM.20 EEPROM.19 EEPROM.18 ; 68.56,48.85 68.56,49.01 74LS161.8 ; 16.54,15.11 16.54,13.28 ; 16.54,15.11 5.83,15.11 3.99,13.27 ; 16.54,15.11 16.54,18.11 21.54,23.11 C2.1 21.48,33.17 C1.1 ; 16.54,13.28 18.54,11.28 27.08,11.28 R12.1 31.07,11.27 39.61,11.27 R13.1 43.61,11.27 52.15,11.27 R14.1 61.15,13.27 ; 16.54,13.28 R11.1
  Bottom Layer w1: R7.1 162.62,44.56 R8.1 163.62,36.71 v1(163.62,31.75) ; R6.1 21.48,45.23 C1.1 ; 74LS04_1.7 132.46,38.59 137.46,33.59 v1(137.46,26.59) ; EEPROM.12 108.28,38.78 108.28,36.84 106.28,34.84 v1(106.28,28.84)
ALU_SUBTRACT: length 158.9
  Top Layer w0.5: H.5 181.76,35.58 140.66,35.58 138.66,37.58 116.16,37.58 114.16,39.58 100.16,39.58 97.66,37.08 97.16,37.08 83.66,23.58 83.66,21.08 77.66,15.08 70.16,15.08 v1(69.66,14.58)
  Bottom Layer w0.5: ALU_SUBTRACT.1 59.2,5.08 60.66,5.08 69.66,14.08 v1(69.66,14.58)
CLR: length 58.6
  Bottom Layer w0.5: 1)ALU_Out2ALU_Sub2.1 9.74,46.99 28.24,28.49 56.59,28.49 74LS00.11
COUNT_EN: length 134.3
  Top Layer w0.5: v1(104.78,31.58) v1(98.28,25.08) ; H.7 189.36,42.16 182.13,34.93 139.94,34.93 138.28,36.58 105.78,36.58 105.28,37.08
  Bottom Layer w0.5: v1(104.78,31.58) 105.28,32.08 105.28,37.08 ; COUNT_EN.1 82.78,8.58 89.28,15.08 92.78,15.08 98.78,21.08 98.78,24.58 v1(98.28,25.08)
HLT: length 146.2
  Top Layer w0.5: HLT.1 195.64,17.09 H.16 194.92,20.8 194.92,47.52 193.92,48.52 172.62,48.52 167.12,54.02 98.12,54.02 EEPROM.17
IR_4: length 102
  Bottom Layer w0.5: 87.39,21.84 84.76,19.22 11.26,19.22 H1.1 ; 87.39,21.84 87.39,34.84 88.89,36.34 88.89,40.4 EEPROM.5 ; 87.39,21.84 EEPROM1.5
IR_5: length 99.6
  Bottom Layer w0.5: H1.2 12.76,20.26 82.76,20.26 84.26,21.76 84.88,21.76 86.38,23.26 86.38,40.37 EEPROM.4
IR_6: length 100.4
  Top Layer w0.5: EEPROM1.3 80.92,20.34 76.22,20.34 v1(75.22,21.34)
  Bottom Layer w0.5: EEPROM.3 81.22,40.58 81.22,28.34 76.22,23.34 76.22,22.84 75.22,21.84 74.72,21.84 ; 74.72,21.84 73.72,21.84 71.26,24.3 11.26,24.3 H1.3 ; 74.72,21.84 v1(75.22,21.34)
IR_7: length 95.4
  Top Layer w0.5: EEPROM1.2 78.39,23.34 v1(75.26,23.34)
  Bottom Layer w0.5: H1.4 12.76,25.34 71.76,25.34 73.76,23.34 v1(75.26,23.34) 79.76,27.84 79.76,35.34 78.76,36.34 78.76,37.84 79.88,38.96 EEPROM.2
IS_CARRY: length 100.7
  Top Layer w0.5: v1(77.49,39.58) 77.49,39.08 79.49,37.08 ; 79.49,37.08 77.49,35.08 v1(76.99,35.08) ; 79.49,37.08 79.88,37.08
  Bottom Layer w0.5: EEPROM.23 78.49,55.63 78.49,40.58 v1(77.49,39.58) ; v1(76.99,35.08) 73.99,35.08 66.49,27.58 17.98,27.58 1)ALU_Out2ALU_Sub1.1
IS_ZERRO: length 101.4
  Top Layer w0.5: 1)ALU_Out2ALU_Sub1.2 12.24,42.87 22.74,42.87 27.74,37.87 69.74,37.87 v1(70.24,37.37) ; v1(73.24,37.37) 76.24,34.37 79.24,34.37 81.74,36.87 82.21,36.87 ; 82.21,36.87 82.71,36.87 v1(83.71,37.87) ; 82.21,36.87 82.42,37.08
  Bottom Layer w0.5: EEPROM.22 83.71,55.74 v1(83.71,37.87) ; v1(70.24,37.37) v1(73.24,37.37)
OUTPUT_IN: length 122.9
  Bottom Layer w0.5: 102.74,37.08 103.74,36.08 103.74,30.08 118.74,15.08 118.74,5.58 119.24,5.08 181.61,5.08 OUTPUT_IN.1 183.1,11.52 H.15
RAM_DATA_IN: length 133.9
  Top Layer w0.5: v1(190.02,23.52) H.13 ; v1(148.2,41.02) 148.2,43.02 139.2,52.02 v1(106.7,52.02) ; v1(154.2,22.02) 154.7,22.52 v1(154.7,26.02)
  Bottom Layer w0.5: v1(148.2,41.02) 154.7,34.52 v1(154.7,26.02) ; v1(154.2,22.02) 157.7,18.52 ; 157.7,18.52 158.02,18.21 RAM_DATA_IN.1 ; 157.7,18.52 185.02,18.52 v1(190.02,23.52) ; EEPROM.15 105.2,52.02 v1(106.7,52.02)
~A_IN: length 71
  Bottom Layer w0.5: 74LS04_1.10 128.88,46.95 132.88,46.95 134.38,48.45 148.88,48.45 157.83,57.4 H.1
~A_OUT: length 71
  Bottom Layer w0.5: 193.42,54.86 194.88,56.32 194.88,58.36 194.38,58.86 157.88,58.86 148.46,49.45 133.46,49.45 74LS04_1.8
~B_IN: length 88.4
  Top Layer w0.5: v1(140.84,20.59) 141.34,20.09 157.84,20.09 160.84,23.09 v1(160.84,24.09)
  Bottom Layer w0.5: v1(160.84,24.09) 160.84,26.09 171.34,36.59 171.34,38.59 176.34,43.59 184.69,43.59 H.3 ; v1(140.84,20.59) 134.34,27.09 126.34,27.09 74LS04_2.4
~CLK: length 47.2
  Top Layer w0.5: ~CLK.1 44.93,57.4 74LS161.2
~CLR: length 76.4
  Top Layer w0.5: 74LS00.5 61.31,23.55 60.19,24.67 ; 60.19,24.67 60.39,24.67 74LS00.8 ; 60.19,24.67 v1(55.19,29.67)
  Bottom Layer w0.5: 55.19,30.67 v1(55.19,29.67) ; 55.19,30.67 74LS00.13 52.19,29.17 28.6,29.17 25.24,32.53 25.24,33.53 9.24,49.53 8.74,49.53 ; 55.19,30.67 74LS00.12
~COUNT_JUMP: length 76.8
  Top Layer w0.5: 74LS04_2.10 129.88,31.09 139.38,31.09 141.38,29.09 144.7,29.09 149.7,34.09 v1(159.38,34.09) ; 193.42,37.08 188.43,32.09 v1(165.38,32.09)
  Bottom Layer w0.5: v1(159.38,34.09) 159.38,32.09 162.38,29.09 162.88,29.09 165.38,31.59 v1(165.38,32.09)
~COUNT_OUT: length 78.2
  Top Layer w0.5: 74LS04_2.12 125.8,30.09 139.3,30.09 141.3,28.09 147.8,28.09 152.8,33.09 186.89,33.09 H.8
~EO: length 99.7
  Top Layer w0.5: v1(164.26,25.09) 158.26,19.09 136.26,19.09 v1(132.76,22.59)
  Bottom Layer w0.5: 74LS04_2.2 122.76,22.59 v1(132.76,22.59) ; v1(164.26,25.09) 164.76,25.59 193.92,25.59 194.92,26.59 194.92,43.2 H.6
~FLAGS_IN: length 77.1
  Top Layer w0.5: 74LS04_2.6 129.92,28.09 130.92,29.09 138.92,29.09 140.92,27.09 159.42,27.09 161.42,29.09 163.92,29.09 v1(164.42,28.59)
  Bottom Layer w0.5: v1(164.42,28.59) 171.92,36.09 179.23,36.09 192.92,49.78 193.42,49.78
~INSTRUCTION_IN: length 97.7
  Bottom Layer w0.5: 74LS04_1.12 124.8,45.95 138.8,45.95 140.3,47.45 151.8,47.45 157.89,53.54 193.92,53.54 194.92,52.54 194.92,49.54 193.92,48.54 192.92,48.54 191.92,47.54 191.92,36.04 H.10
~INSTRUCTION_OUT: length 69.1
  Top Layer w0.5: v1(182.92,37.95) 177.92,42.95 v1(155.92,42.95)
  Bottom Layer w0.5: v1(182.92,37.95) 187.48,37.95 193.42,32 ; 74LS04_1.6 132.42,42.95 v1(155.92,42.95)
~RAM_ADR_IN: length 87.3
  Top Layer w0.5: v1(137.76,38.45) 136.76,38.45 133.26,41.95 121.26,41.95 74LS04_1.2
  Bottom Layer w0.5: v1(137.76,38.45) 143.26,32.95 148.26,32.95 153.76,27.45 153.76,25.45 157.76,21.45 159.26,21.45 164.76,26.95 190.91,26.95 H.12
~RAM_DATA_OUT: length 80
  Top Layer w0.5: v1(134.34,38.45) 126.84,38.45 74LS04_1.4
  Bottom Layer w0.5: v1(134.34,38.45) 140.34,32.45 140.34,29.95 145.84,24.45 153.34,24.45 157.34,20.45 159.34,20.45 163.27,24.38 H.14
$1N2639: length 7.6
  Bottom Layer w0.5: LEDG9.1 143.54,53.52 146.85,53.52 R5.1
$1N2640: length 7.6
  Bottom Layer w0.5: R1.1 146.85,46.42 143.54,46.42 LEDG10.1
$1N2641: length 7.6
  Bottom Layer w0.5: LEDG11.1 143.54,39.33 146.85,39.33 R2.1
$1N2642: length 7.6
  Bottom Layer w0.5: R3.1 146.85,32.22 143.54,32.22 LEDG12.1
$1N2643: length 7.6
  Top Layer w0.5: LEDG13.1 142.54,23 144.04,21.5 146.85,21.5 R4.1
$1N2644: length 102.2
  Top Layer w0.5: LEDG13.2 141.58,26 141.08,26 139.08,28 v1(131.08,28) ; v1(68.58,39.82) 56.32,39.82 52.32,43.82 ; v1(73.08,39.82) 73.58,40.32 114.76,40.32 116.08,39 v1(120.58,39)
  Bottom Layer w0.5: v1(120.58,39) 121.58,39 126.08,34.5 126.08,33 v1(131.08,28) ; v1(73.08,39.82) v1(68.58,39.82)
$1N2645: length 93.6
  Top Layer w0.5: v1(65.19,47.52) 66.69,49.02 66.69,50.52 74.69,58.52 v1(85.08,58.52)
  Bottom Layer w0.5: v1(85.08,58.52) 106.08,58.52 114.08,50.52 143.08,50.52 LEDG9.2 ; 74LS138.11 62.48,44.82 v1(65.19,47.52)
$1N2646: length 105.9
  Top Layer w0.5: v1(134.08,42.22) 132.58,43.72 76.08,43.72 v1(75.08,44.72) ; v1(138.08,35.72) 140.58,33.22 142.08,33.22 LEDG12.2 ; 74LS138.14 59.08,48.03 59.08,50.22 60.58,51.72 v1(66.58,51.72)
  Bottom Layer w0.5: v1(66.58,51.72) 67.08,51.22 71.08,51.22 75.08,47.22 v1(75.08,44.72) ; v1(138.08,35.72) 134.08,39.72 v1(134.08,42.22)
$1N2647: length 97.2
  Top Layer w0.5: 57.4,43.82 58.92,45.33 v1(64.08,45.33) ; LEDG11.2 136.58,45.83 133.08,45.83 131.08,47.83 131.08,49.33 130.08,50.33 106.08,50.33 v1(104.58,48.83) ; v1(69.58,48.33) 71.58,50.33 v1(93.08,50.33)
  Bottom Layer w0.5: v1(69.58,48.33) 67.08,48.33 v1(64.08,45.33) ; v1(93.08,50.33) 103.08,50.33 v1(104.58,48.83)
$1N2648: length 91.8
  Top Layer w0.5: LEDG10.2 138.18,51.32 105.68,51.32 100.18,45.82 v1(73.18,45.82)
  Bottom Layer w0.5: v1(73.18,45.82) 69.45,42.08 61.68,42.08 74LS138.12
$1N2653: length 43.9
  Top Layer w0.5: v1(48,31.74) 48.5,32.24 59.74,32.24 74LS00.10 74LS00.9 ; v1(37.03,38.84) 29.03,46.84 R6.2
  Bottom Layer w0.5: v1(37.03,38.84) 37.03,37.2 SW1.1 42.5,31.74 v1(48,31.74)
$1N2655: length 34.1
  Top Layer w0.5: v1(68.52,35.32) v1(68.52,32.43) ; v1(67.52,38.82) 69.02,38.82 69.52,39.32 69.52,40.1 65.81,43.82 74LS138.10 ; v1(66.02,28.43) 62.52,24.93 62.52,21.67 62.02,21.17 60.27,21.17 74LS00.4
  Bottom Layer w0.5: v1(68.52,32.43) 68.52,30.93 v1(66.02,28.43) ; v1(68.52,35.32) 69.02,35.82 69.02,37.32 v1(67.52,38.82)
$1N2658: length 13.9
  Bottom Layer w0.5: 74LS00.1 74LS00.2 55.19,21.17 62.35,21.17 74LS00.6
$1N2659: length 31.9
  Top Layer w0.5: v1(48.17,41.12) 48.17,47.62 74LS161.1 ; 74LS00.3 49.67,29.23 v1(49.67,30.12)
  Bottom Layer w0.5: v1(48.17,41.12) 48.17,39.12 47.17,38.12 47.17,34.12 49.67,31.62 v1(49.67,30.12)
$1N2661: length 178.7
  Top Layer w0.5: v1(64.62,18.46) 52.62,18.46 47.28,23.8 47.28,33.7 74LS138.1 ; LED6.1 175.21,44.81 169.71,50.31 148.1,50.31 145.1,53.31 106.21,53.31 v1(99.71,46.81)
  Bottom Layer w0.5: 95.12,25.96 95.12,27.46 93.71,28.87 93.71,40.37 95.21,41.87 95.21,42.31 v1(99.71,46.81) ; 95.12,25.96 EEPROM1.8 ; 95.12,25.96 92.12,25.96 88.62,22.46 88.62,20.96 86.12,18.46 v1(64.62,18.46)
$1N2662: length 168.1
  Top Layer w0.5: LED7.1 175.03,36.28 141.38,36.28 132.88,44.78 104.88,44.78 v1(104.38,45.28) ; v1(91.08,39.28) v1(78.58,39.28)
  Bottom Layer w0.5: v1(91.08,39.28) 92.58,40.78 EEPROM.7 98.58,47.78 101.88,47.78 v1(104.38,45.28) 101.38,42.28 101.38,40.78 98.88,38.28 98.88,36.28 96.38,33.78 96.38,21.14 95.38,20.14 94.28,20.14 EEPROM1.7 ; 52.32,36.2 55.91,39.78 67.58,39.78 68.58,38.78 78.08,38.78 v1(78.58,39.28)
$1N2666: length 7.5
  Bottom Layer w0.5: R7.2 174.54,46.31 177.75,46.31 LED6.2
$1N2667: length 7.5
  Bottom Layer w0.5: LED7.2 177.5,39.21 174.28,39.21 R8.2
$1N2668: length 7.5
  Bottom Layer w0.5: R9.2 174.28,32.25 177.5,32.25 LED8.2
$1N2703: length 164
  Top Layer w0.5: 91.96,23.34 97.96,23.34 105.46,30.84 107.96,30.84 115.96,22.84 v1(118.96,22.84) ; 91.96,23.34 90.46,24.84 v1(90.46,27.84) ; 91.96,23.34 91.54,23.34 EEPROM1.6 ; v1(60.96,26.84) 60.96,28.84 v1(59.96,29.84) ; 74LS138.3 56.46,34.6 58.46,34.6 v1(60.46,32.6) ; v1(68.46,27.34) 83.46,27.34 v1(88.46,32.34) ; v1(134.96,21.75) 142.46,21.75 143.46,20.75 153.96,20.75 158.46,25.25 161.96,25.25 v1(164.46,27.75)
  Bottom Layer w0.5: 90.46,32.84 88.96,32.84 v1(88.46,32.34) ; 90.46,32.84 91.46,33.84 91.46,37.84 90.04,39.26 EEPROM.6 ; 90.46,32.84 v1(90.46,27.84) ; v1(68.46,27.34) 67.96,26.84 v1(60.96,26.84) ; v1(60.46,32.6) 59.96,32.1 v1(59.96,29.84) ; v1(164.46,27.75) 173.46,27.75 LED8.1 ; v1(118.96,22.84) 120.05,21.75 v1(134.96,21.75)
$1N12063: length 90.8
  Top Layer w0.5: v1(157.3,11.95) 162.67,6.58 RAM_DATA_OUT.1
  Bottom Layer w0.5: v1(157.3,11.95) 157.3,12.45 154.8,14.95 147.8,14.95 131.3,31.45 131.3,34.45 130.3,35.45 127.3,35.45 74LS04_1.3 120.73,42.02 118.24,42.02 103.24,57.02 EEPROM.14
$1N12068: length 50.9
  Top Layer w0.5: v1(111.84,32.09) 114.84,35.09 123.34,35.09 74LS04_2.11 ; v1(102.2,16.84) 100.2,18.84 EEPROM1.10 100.45,22.09 100.45,24.59 105.95,30.09 v1(107.45,30.09)
  Bottom Layer w0.5: v1(107.45,30.09) 109.45,32.09 v1(111.84,32.09) ; v1(102.2,16.84) 102.7,16.84 107.86,11.69 COUNT_JUMP.1
$1N12073: length 59.3
  Top Layer w0.5: v1(106.01,20.34) 124.01,20.34 128.76,25.09 128.76,26.09 127.76,27.09 126.26,27.09 74LS04_2.13
  Bottom Layer w0.5: COUNT_OUT.1 95.32,11.15 104.51,20.34 ; v1(106.01,20.34) 104.51,20.34 ; 104.51,20.34 104.24,20.34 EEPROM1.11
$1N12083: length 68.9
  Top Layer w0.5: 74LS04_2.1 107.22,35.59 v1(96.72,35.59) 86.22,25.09 86.22,21.09 80.22,15.09 v1(78.72,15.09)
  Bottom Layer w0.5: v1(96.72,35.59) 96.62,35.59 95.12,37.08 ; v1(78.72,15.09) 76.72,15.09 70.22,8.59 70.22,6.6 EO.1
$1N12093: length 97.3
  Top Layer w0.5: 74LS04_2.5 123.88,22.09 107.38,22.09 v1(106.38,23.09)
  Bottom Layer w0.5: v1(106.38,23.09) 103.38,26.09 97.91,26.09 97.41,25.59 97.41,22.09 EEPROM1.9 97.66,21.34 92.16,15.84 59.16,15.84 48.66,5.34 46.4,5.34 FLAGS_IN.1
$1N12098: length 112.3
  Top Layer w0.5: v1(92.3,24.09) v1(102.8,34.59) 105.3,34.59 115.8,24.09 120.8,24.09 74LS04_2.3
  Bottom Layer w0.5: v1(102.8,34.59) 102.7,34.59 100.2,37.08 ; B_IN.1 34.11,5.09 35.8,5.09 47.3,16.59 86.8,16.59 91.3,21.09 91.3,23.09 v1(92.3,24.09)
$1N12103: length 155.7
  Top Layer w0.5: v1(25.29,13.28) 25.29,15.28 v1(42.79,32.78) ; v1(103.66,52.28) 100.66,49.28 72.66,49.28 72.16,48.78 72.16,44.78 v1(74.16,42.78) ; 74LS04_1.9 127.42,45.95 v1(123.66,45.95) ; v1(108.66,48.28) 105.16,48.28 v1(102.66,45.78) ; v1(122.16,46.95) 112.16,46.95 v1(111.16,47.95) ; v1(50.29,38.78) v1(46.79,38.78)
  Bottom Layer w0.5: v1(102.66,45.78) 101.66,45.78 EEPROM.9 ; v1(50.29,38.78) 52.29,40.78 72.16,40.78 v1(74.16,42.78) ; v1(122.16,46.95) 122.66,46.95 v1(123.66,45.95) ; v1(103.66,52.28) 107.66,48.28 v1(108.66,48.28) 110.83,48.28 v1(111.16,47.95) ; A_OUT.1 20.08,8.08 v1(25.29,13.28) ; v1(46.79,38.78) 42.79,34.78 v1(42.79,32.78)
$1N12108: length 137.9
  Top Layer w0.5: v1(95.7,38.78) 94.7,38.78 93.7,37.78 93.7,36.28 81.7,24.28 73.7,24.28 v1(64.2,14.78) ; v1(102.7,44.78) 104.16,46.24 122.63,46.24 74LS04_1.11
  Bottom Layer w0.5: v1(102.7,44.78) 100.2,42.28 EEPROM.10 97.2,38.78 v1(95.7,38.78) ; A_IN.1 10.04,4.08 48.5,4.08 59.2,14.78 v1(64.2,14.78)
$1N12115: length 63.9
  Top Layer w0.5: v1(108.74,42.78) v1(118.59,42.78)
  Bottom Layer w0.5: v1(118.59,42.78) 118.59,47.28 74LS04_1.13 ; INSTRUCTION_IN.1 120.4,18.63 115.74,23.28 115.74,35.78 v1(108.74,42.78) 107.24,42.78 106.74,43.28 104.24,43.28 EEPROM.11
$1N12122: length 84.5
  Top Layer w0.5: v1(130.94,35.87) v1(120.94,35.87) ; v1(117.28,45.52) v1(119.78,45.52)
  Bottom Layer w0.5: 127.28,40.52 127.28,39.52 v1(130.94,35.87) ; 127.28,40.52 126.78,40.52 121.78,45.52 v1(119.78,45.52) ; 127.28,40.52 74LS04_1.5 ; EEPROM.13 105.78,57.02 v1(117.28,45.52) ; v1(120.94,35.87) 120.94,28.87 118.44,26.37 118.44,23.37 117.94,22.87 117.94,22.37 125.44,14.87 129.94,14.87 132.94,11.87 INSTRUCTION_OUT.1
$1N12129: length 78.6
  Bottom Layer w0.5: 116.66,40.52 74LS04_1.1 ; 116.66,40.52 117.66,40.52 123.66,34.52 123.66,24.52 124.66,23.52 134.53,23.52 145.48,12.58 RAM_ADR_IN.1 ; 116.66,40.52 114.16,40.52 EEPROM.16
$1N12393: length 8.4
  Bottom Layer w0.5: R10.2 10.08,9.2 A_IN.2
$1N12395: length 8.4
  Bottom Layer w0.5: R11.2 22.62,9.2 A_OUT.2
$1N12397: length 8.4
  Bottom Layer w0.5: R12.2 35.16,9.2 B_IN.2
$1N12399: length 8.4
  Bottom Layer w0.5: FLAGS_IN.2 47.7,9.2 R13.2
$1N12401: length 8.4
  Bottom Layer w0.5: R14.2 60.24,9.2 ALU_SUBTRACT.2
$1N12403: length 8.4
  Bottom Layer w0.5: R15.2 72.78,9.2 EO.2
$1N12405: length 8.4
  Bottom Layer w0.5: COUNT_EN.2 85.32,9.2 R16.2
$1N12407: length 8.4
  Bottom Layer w0.5: COUNT_OUT.2 97.86,9.2 R17.2
$1N12409: length 8.4
  Bottom Layer w0.5: R18.2 110.4,9.2 COUNT_JUMP.2
$1N12411: length 8.4
  Bottom Layer w0.5: R19.2 122.94,9.2 INSTRUCTION_IN.2
$1N12413: length 8.4
  Bottom Layer w0.5: INSTRUCTION_OUT.2 135.48,9.2 139.54,13.27
$1N12415: length 8.4
  Bottom Layer w0.5: R21.2 152.08,10.64 RAM_ADR_IN.2
$1N12417: length 8.4
  Bottom Layer w0.5: R22.2 164.62,10.64 RAM_DATA_IN.2
$1N12419: length 8.4
  Bottom Layer w0.5: R23.2 177.16,10.64 RAM_DATA_OUT.2
$1N12421: length 8.4
  Bottom Layer w0.5: OUTPUT_IN.2 185.64,9.2 R24.2
$1N12423: length 8.4
  Bottom Layer w0.5: HLT.2 198.18,9.2 R25.2
